# Altium schematic sheet wfp connector.SchDoc
size A4; SheetNumber: 3; SheetTotal: 5
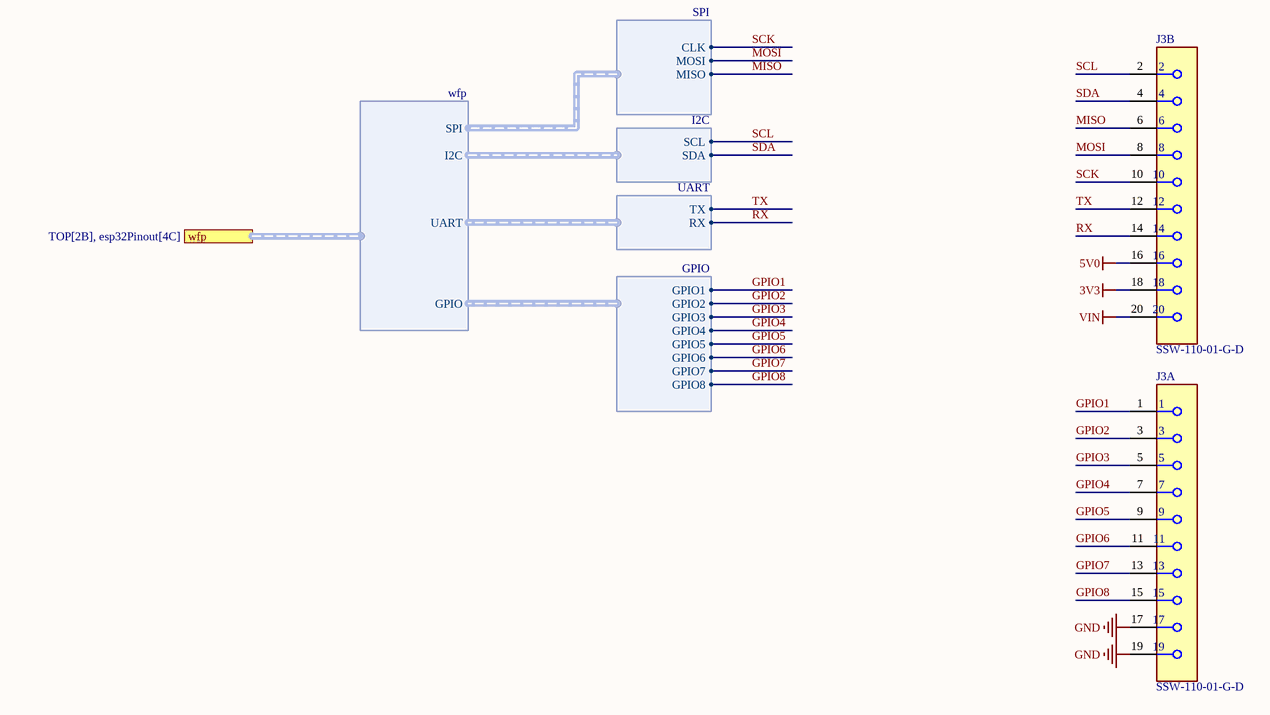
[diagram p0: wfp connector.SchDoc]

## Parts
J3  SSW-110-01-G-D  [FP-SSW-110-01-G-D-MFG]  (parts A,B of 2)

## Ports
wfp (harness wfp, see TOP[2B], esp32Pinout[4C])

## Harnesses
wfp: SPI, I2C, GPIO, UART
SPI: CLK, MOSI, MISO
I2C: SCL, SDA
UART: TX, RX
GPIO: GPIO1, GPIO2, GPIO3, GPIO4, GPIO5, GPIO6, GPIO7, GPIO8

## Nets
3V3: J3.18
5V0: J3.16
GND: J3.17 J3.19
VIN: J3.20
GPIO1: J3.1 ; harness GPIO.GPIO1
GPIO2: J3.3 ; harness GPIO.GPIO2
GPIO3: J3.5 ; harness GPIO.GPIO3
GPIO4: J3.7 ; harness GPIO.GPIO4
GPIO5: J3.9 ; harness GPIO.GPIO5
GPIO6: J3.11 ; harness GPIO.GPIO6
GPIO7: J3.13 ; harness GPIO.GPIO7
GPIO8: J3.15 ; harness GPIO.GPIO8
MISO: J3.6 ; harness SPI.MISO
MOSI: J3.8 ; harness SPI.MOSI
RX: J3.14 ; harness UART.RX
SCK: J3.10 ; harness SPI.CLK
SCL: J3.2 ; harness I2C.SCL
SDA: J3.4 ; harness I2C.SDA
TX: J3.12 ; harness UART.TX

## Library data of the parts
J3 = CMP-02766-000052-2: CONN RCPT 20POS 0.1 GOLD PCB; Max Voltage Rating (AC): 550V; Connector Type: Receptacle; Pitch: 2.54mm; Row Spacing: 0.1inch; Number of Positions: 20; Mating Cycles: 100; Contact Resistance: 10mR; Current Rating: 6.9A; Mount: Through Hole; REACH SVHC: No SVHC; Max Operating Temperature: 125°C; Radiation Hardening: No; Series: SSW; RoHS Compliant: Yes; Housing Color: Black; Min Operating Temperature: -55°C; Lead Free: Lead Free; Voltage Rating: 550V; Contact Plating: Gold; Lead Pitch: 2.54mm; Color: Black; Housing Material: Polymer; Length: 25.91mm; Termination: Solder; Contact Material: Bronze; Orientation: Straight; Gender: Receptacle; Number of Contacts: 20; Depth: 4.95mm; Max Current Rating: 6.9A; Packaging: Bulk; Number of Rows: 2; Contact Type: Female Socket